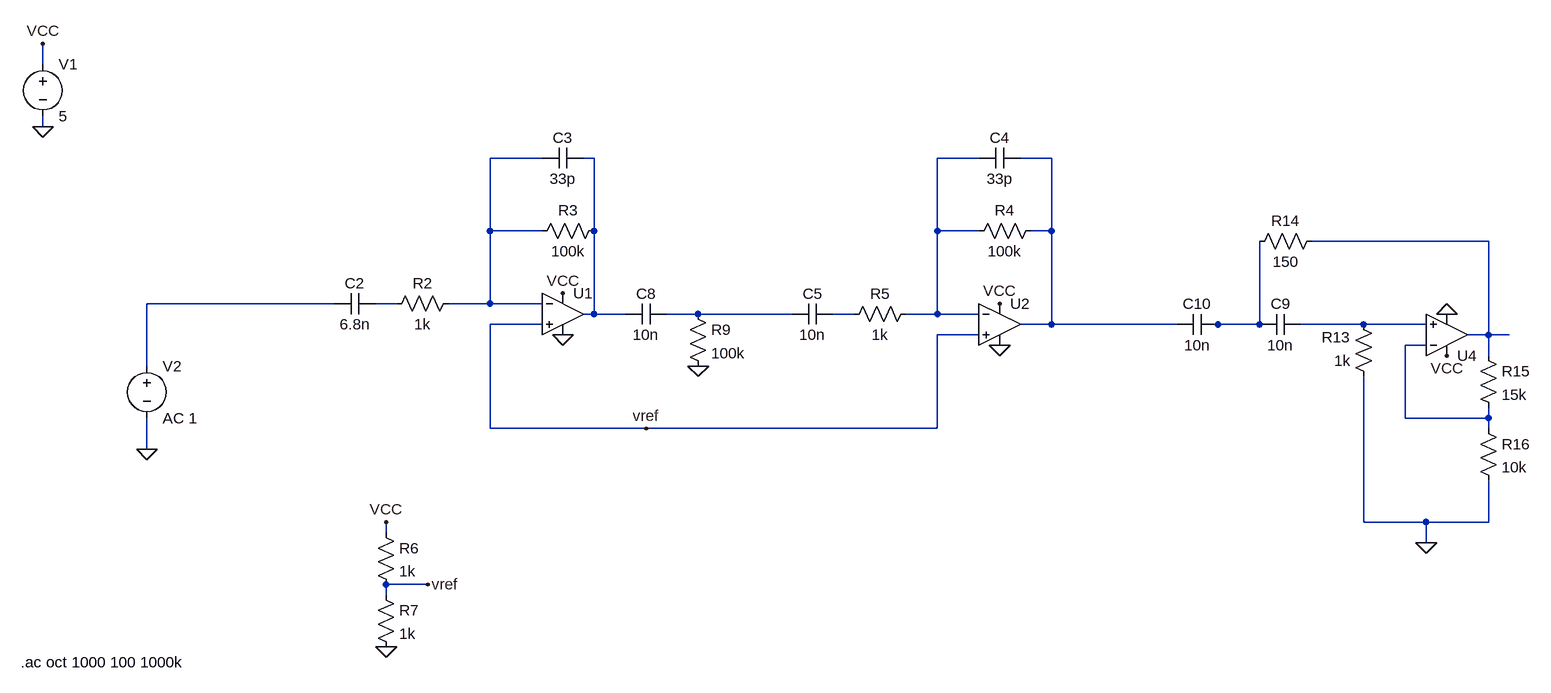
[diagram p0: schematic Draft1.asc]
Draft1.asc, the LTspice schematic file:
Version 4
SHEET 1 2324 680
WIRE -208 -256 -208 -288
WIRE -208 -160 -208 -176
WIRE 560 -112 480 -112
WIRE 640 -112 624 -112
WIRE 1232 -112 1168 -112
WIRE 1344 -112 1296 -112
WIRE 480 0 480 -112
WIRE 560 0 480 0
WIRE 640 0 640 -112
WIRE 1168 0 1168 -112
WIRE 1232 0 1168 0
WIRE 1344 0 1344 -112
WIRE 1344 0 1312 0
WIRE 2016 16 1744 16
WIRE 240 112 -48 112
WIRE 336 112 304 112
WIRE 480 112 480 0
WIRE 480 112 416 112
WIRE 560 112 480 112
WIRE 640 128 640 0
WIRE 640 128 624 128
WIRE 688 128 640 128
WIRE 800 128 752 128
WIRE 944 128 800 128
WIRE 1040 128 1008 128
WIRE 1168 128 1168 0
WIRE 1168 128 1120 128
WIRE 1232 128 1168 128
WIRE 560 144 480 144
WIRE 1344 144 1344 0
WIRE 1344 144 1296 144
WIRE 1536 144 1344 144
WIRE 1600 144 1584 144
WIRE 1664 144 1664 16
WIRE 1664 144 1600 144
WIRE 1824 144 1728 144
WIRE 1920 144 1824 144
WIRE 1232 160 1168 160
WIRE 2016 160 2016 16
WIRE 2016 160 1984 160
WIRE 2048 160 2016 160
WIRE 1920 176 1888 176
WIRE 2016 192 2016 160
WIRE -48 208 -48 112
WIRE 1888 288 1888 176
WIRE 2016 288 2016 272
WIRE 2016 288 1888 288
WIRE 480 304 480 144
WIRE 720 304 480 304
WIRE 1168 304 1168 160
WIRE 1168 304 720 304
WIRE 2016 304 2016 288
WIRE -48 336 -48 288
WIRE 1824 448 1824 224
WIRE 1920 448 1824 448
WIRE 2016 448 2016 384
WIRE 2016 448 1920 448
WIRE 320 464 320 448
WIRE 1920 480 1920 448
WIRE 384 544 320 544
WIRE 320 560 320 544
FLAG -208 -160 0
FLAG -208 -288 VCC
FLAG 592 96 VCC
FLAG 1264 112 VCC
FLAG 592 160 0
FLAG 1264 176 0
FLAG 720 304 vref
FLAG 320 640 0
FLAG 320 448 VCC
FLAG 384 544 vref
FLAG -48 336 0
FLAG 800 208 0
FLAG 1952 192 VCC
FLAG 1952 128 0
FLAG 1920 480 0
SYMBOL cap 240 128 R270
WINDOW 0 32 32 VTop 2
WINDOW 3 0 32 VBottom 2
SYMATTR InstName C2
SYMATTR Value 6.8n
SYMBOL res 432 96 R90
WINDOW 0 0 56 VBottom 2
WINDOW 3 32 56 VTop 2
SYMATTR InstName R2
SYMATTR Value 1k
SYMBOL res 656 -16 R90
WINDOW 0 0 56 VBottom 2
WINDOW 3 32 56 VTop 2
SYMATTR InstName R3
SYMATTR Value 100k
SYMBOL res 1328 -16 R90
WINDOW 0 0 56 VBottom 2
WINDOW 3 32 56 VTop 2
SYMATTR InstName R4
SYMATTR Value 100k
SYMBOL cap 624 -128 R90
WINDOW 0 0 32 VBottom 2
WINDOW 3 32 32 VTop 2
SYMATTR InstName C3
SYMATTR Value 33p
SYMBOL cap 1296 -128 R90
WINDOW 0 0 32 VBottom 2
WINDOW 3 32 32 VTop 2
SYMATTR InstName C4
SYMATTR Value 33p
SYMBOL Opamps\\UniversalOpamp2 592 128 R0
SYMATTR InstName U1
SYMBOL Opamps\\UniversalOpamp2 1264 144 R0
SYMATTR InstName U2
SYMBOL voltage -208 -272 R0
WINDOW 123 0 0 Left 0
WINDOW 39 0 0 Left 0
SYMATTR InstName V1
SYMATTR Value 5
SYMBOL voltage -48 192 R0
SYMATTR InstName V2
SYMATTR Value AC 1
SYMBOL cap 1008 112 R90
WINDOW 0 0 32 VBottom 2
WINDOW 3 32 32 VTop 2
SYMATTR InstName C5
SYMATTR Value 10n
SYMBOL res 1136 112 R90
WINDOW 0 0 56 VBottom 2
WINDOW 3 32 56 VTop 2
SYMATTR InstName R5
SYMATTR Value 1k
SYMBOL res 304 544 R0
SYMATTR InstName R7
SYMATTR Value 1k
SYMBOL res 304 448 R0
SYMATTR InstName R6
SYMATTR Value 1k
SYMBOL cap 688 144 R270
WINDOW 0 32 32 VTop 2
WINDOW 3 0 32 VBottom 2
SYMATTR InstName C8
SYMATTR Value 10n
SYMBOL res 784 112 R0
SYMATTR InstName R9
SYMATTR Value 100k
SYMBOL cap 1664 160 R270
WINDOW 0 32 32 VTop 2
WINDOW 3 0 32 VBottom 2
SYMATTR InstName C9
SYMATTR Value 10n
SYMBOL res 1840 240 R180
WINDOW 0 36 76 Left 2
WINDOW 3 36 40 Left 2
SYMATTR InstName R13
SYMATTR Value 1k
SYMBOL Opamps\\UniversalOpamp2 1952 160 M180
SYMATTR InstName U4
SYMBOL res 1760 0 R90
WINDOW 0 0 56 VBottom 2
WINDOW 3 32 56 VTop 2
SYMATTR InstName R14
SYMATTR Value 150
SYMBOL res 2000 176 R0
SYMATTR InstName R15
SYMATTR Value 15k
SYMBOL res 2000 288 R0
SYMATTR InstName R16
SYMATTR Value 10k
SYMBOL cap 1536 160 R270
WINDOW 0 32 32 VTop 2
WINDOW 3 0 32 VBottom 2
SYMATTR InstName C10
SYMATTR Value 10n
TEXT -242 664 Left 2 !.ac oct 1000 100 1000k

The netlist it stands for:
* Draft1.asc
C2 N006 N007 6.8n
R2 N001 N007 1k
R3 N002 N001 100k
R4 N004 N003 100k
C3 N002 N001 33p
C4 N004 N003 33p
XU1 vref N001 VCC 0 N002 level.2 Avol=1Meg GBW=10Meg Slew=10Meg ilimit=25m rail=0 Vos=0 phimargin=45 en=0 enk=0 in=0 ink=0 Rin=500Meg  ; pins IN+ IN- V+ V- OUT
XU2 vref N003 VCC 0 N004 level.2 Avol=1Meg GBW=10Meg Slew=10Meg ilimit=25m rail=0 Vos=0 phimargin=45 en=0 enk=0 in=0 ink=0 Rin=500Meg  ; pins IN+ IN- V+ V- OUT
V1 VCC 0 5
V2 N006 0 AC 1
C5 N009 N008 10n
R5 N003 N009 1k
R7 vref 0 1k
R6 VCC vref 1k
C8 N002 N008 10n
R9 N008 0 100k
C9 N010 N011 10n
R13 0 N011 1k
XU4 N011 N012 VCC 0 N005 level.2 Avol=1Meg GBW=10Meg Slew=10Meg ilimit=25m rail=0 Vos=0 phimargin=45 en=0 enk=0 in=0 ink=0 Rin=500Meg  ; pins IN+ IN- V+ V- OUT
R14 N005 N010 150
R15 N005 N012 15k
R16 N012 0 10k
C10 N004 N010 10n
.ac oct 1000 100 1000k
.lib UniversalOpamps2.sub
.backanno
.end